# Altium project Project-Files.PrjPcb
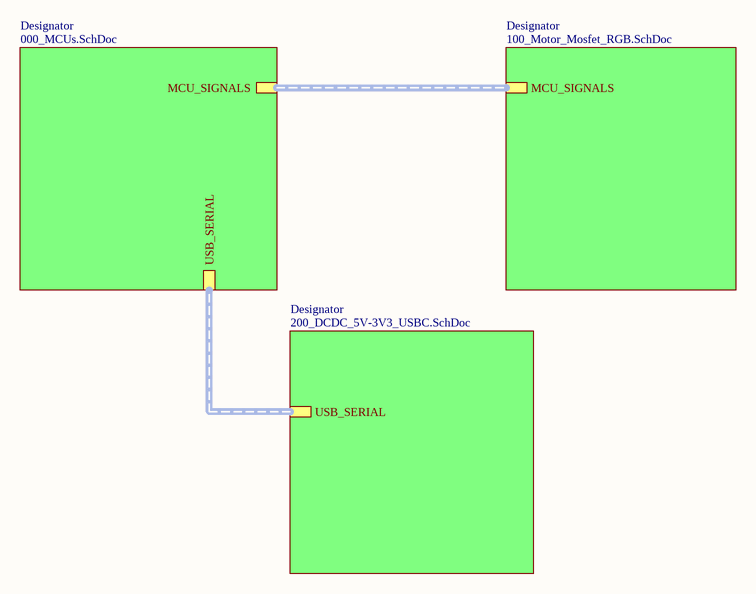
[diagram p0: Main.SchDoc]
4 sheets, 68 parts. Net scope: hierarchical (ports join the sheet entries above them; power ports are global).
Board file: PCB_v1.PcbDoc
Sheets:
  Main.SchDoc
    Designator = 000_MCUs.SchDoc
    Designator = 100_Motor_Mosfet_RGB.SchDoc
    Designator = 200_DCDC_5V-3V3_USBC.SchDoc

## Sheet Main.SchDoc
size A; SheetNumber: 1; SheetTotal: 4

### Sub-sheets
Designator = 000_MCUs.SchDoc: MCU_SIGNALS (harness MCU_SIGNALS), USB_SERIAL (harness USB_SERIAL)
Designator = 100_Motor_Mosfet_RGB.SchDoc: MCU_SIGNALS (harness MCU_SIGNALS)
Designator = 200_DCDC_5V-3V3_USBC.SchDoc: USB_SERIAL (harness USB_SERIAL)

## Sheet 000_MCUs.SchDoc
size A4; SheetNumber: 2; SheetTotal: 4
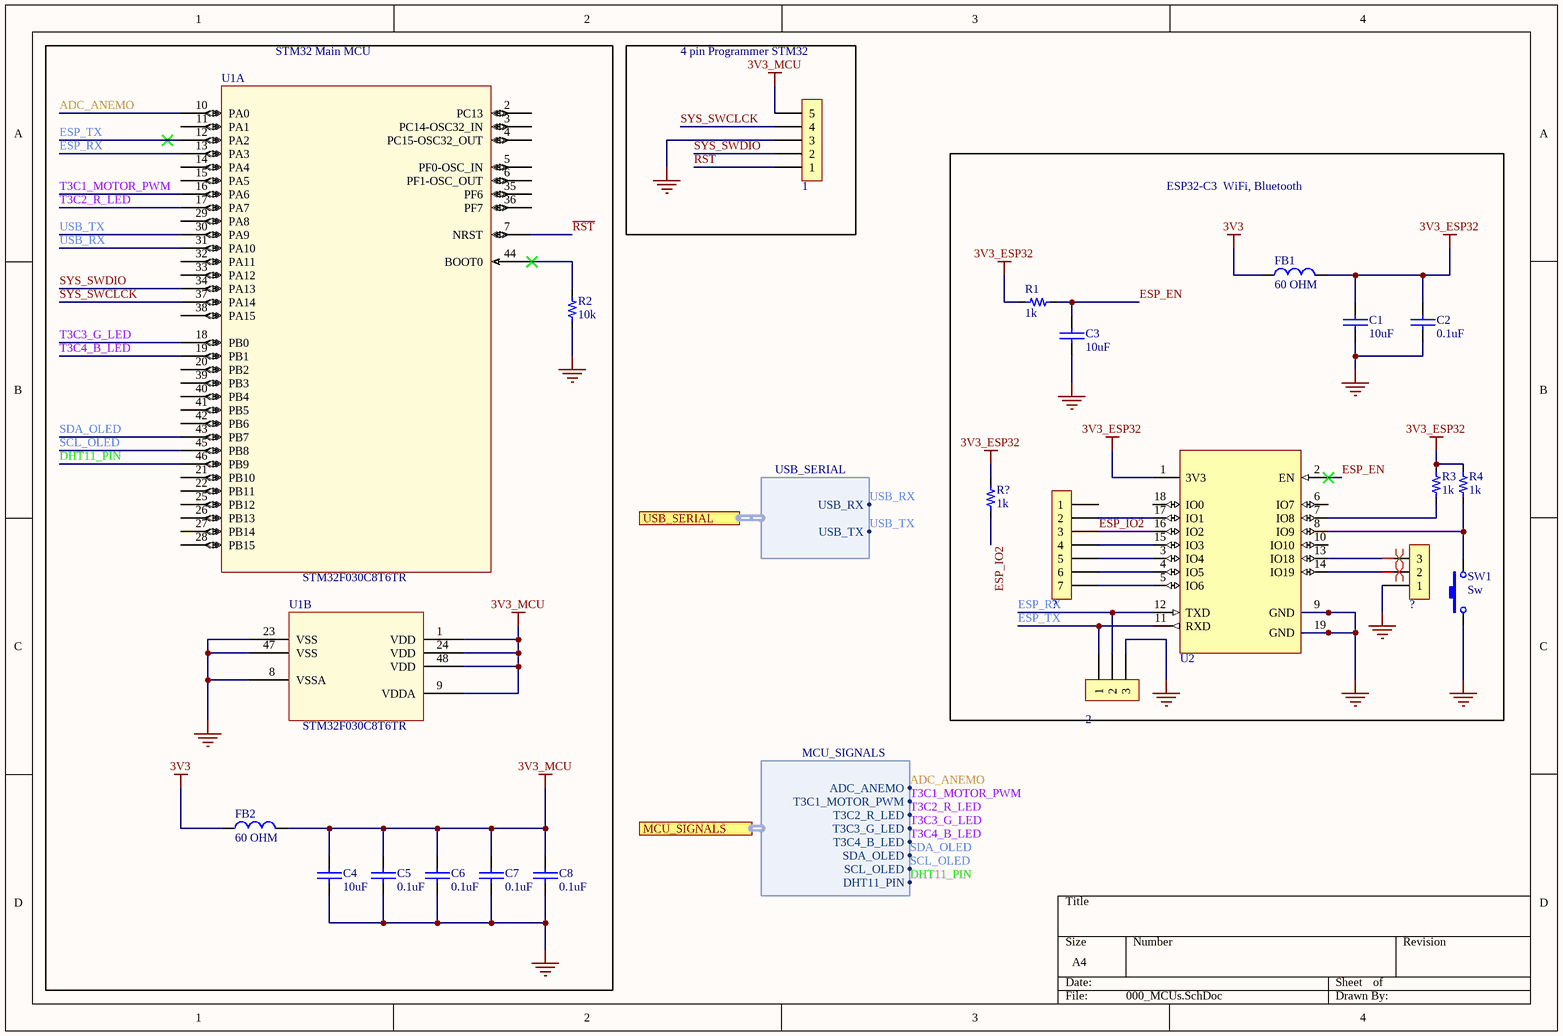
[diagram p1: 000_MCUs.SchDoc]

### Parts
(Parts that share a designator on the sheet are numbered #1, #2 ... from top to bottom, then left to right.)
1  5x1  [H_5x1_TH_100mil]  (value not drawn)  (no BOM)
2  3x1  [H_3X1_TH_100mil]  (value not drawn)  (no BOM)
?#1  7x1  [H_7x1_TH_100mil]  (value not drawn)  (no BOM)
?#2  3x1  [H_3X1_TH_100mil]  (value not drawn)  (no BOM)
C1  value 10uF  [0805_cap]  (hidden comment: 10uF 25V)
C2  value 0.1uF  [0603_cap]  (hidden comment: 0.1uF 50V)
C3  value 10uF  [0805_cap]  (hidden comment: 10uF 25V)
C4  value 10uF  [0805_cap]  (hidden comment: 10uF 25V)
C5  value 0.1uF  [0603_cap]  (hidden comment: 0.1uF 50V)
C6  value 0.1uF  [0603_cap]  (hidden comment: 0.1uF 50V)
C7  value 0.1uF  [0603_cap]  (hidden comment: 0.1uF 50V)
C8  value 0.1uF  [0603_cap]  (hidden comment: 0.1uF 50V)
FB1  value 60 OHM  [0603_fb]  (hidden comment: 60OHM 2A)
FB2  value 60 OHM  [0603_fb]  (hidden comment: 60OHM 2A)
R1  value 1k  [0603_res]  (hidden comment: 1k 1/10W)
R2  value 10k  [0603_res]  (hidden comment: 10k 1/10W)
R3  value 1k  [0603_res]  (hidden comment: 1k 1/10W)
R4  value 1k  [0603_res]  (hidden comment: 1k 1/10W)
R?  value 1k  [0603_res]  (hidden comment: 1k 1/10W)
SW1  Sw  [Sw_PUSH_4.5x4.5x5mm]
U1  STM32F030C8T6TR  [LQFP48_7x7mm]  (parts A,B of 2)
U2  ESP32-C3-WROOM-02-N4  [ESP32-C3-WROOM-02-N4]  (value not drawn)

### Blocks framed on the sheet
STM32 Main MCU: C4-C8 FB2 R2 U1
4 pin Programmer STM32: 1
ESP32-C3  WiFi, Bluetooth: 2 ?#1 ?#2 C1-C3 FB1 R1 R3 R4 R? SW1 U2

### Ports
MCU_SIGNALS (harness MCU_SIGNALS, see Main[2A], 100_Motor_Mosfet_RGB[1B]), USB_SERIAL (harness USB_SERIAL, see Main[2B], 200_DCDC_5V-3V3_USBC[3B])

### Harnesses
MCU_SIGNALS: ADC_ANEMO, T3C1_MOTOR_PWM, T3C2_R_LED, T3C3_G_LED, T3C4_B_LED, SDA_OLED, SCL_OLED, DHT11_PIN
USB_SERIAL: USB_RX, USB_TX

### Nets
3V3: FB1.1 FB2.1
3V3_ESP32: C1.1 C2.1 FB1.2 R1.2 R3.2 R4.2 R?.2 U2.1(3V3)
3V3_MCU: 1.5 C4.1 C5.1 C6.1 C7.1 C8.1 FB2.2 U1.1(VDD) U1.9(VDDA) U1.24(VDD) U1.48(VDD)
GND: 1.3 2.3 ?#2.1 C1.2 C2.2 C3.2 C4.2 C5.2 C6.2 C7.2 C8.2 R2.1 SW1.1 U1.8(VSSA) U1.23(VSS) U1.47(VSS) U2.9(GND) U2.19(GND)
ADC_ANEMO: U1.10(PA0) ; port MCU_SIGNALS.ADC_ANEMO
DHT11_PIN: U1.46(PB9) ; port MCU_SIGNALS.DHT11_PIN
ESP_EN: C3.1 R1.1 U2.2(EN)
ESP_IO2: ?#1.3 R?.1 U2.16(IO2)
ESP_RX: 2.2 U1.13(PA3) U2.12(TXD)
ESP_TX: 2.1 U1.12(PA2) U2.11(RXD)
~{RST}: 1.1 U1.7(NRST)
SCL_OLED: U1.45(PB8) ; port MCU_SIGNALS.SCL_OLED
SDA_OLED: U1.43(PB7) ; port MCU_SIGNALS.SDA_OLED
SYS_SWCLCK: 1.4 U1.37(PA14)
SYS_SWDIO: 1.2 U1.34(PA13)
T3C1_MOTOR_PWM: U1.16(PA6) ; port MCU_SIGNALS.T3C1_MOTOR_PWM
T3C2_R_LED: U1.17(PA7) ; port MCU_SIGNALS.T3C2_R_LED
T3C3_G_LED: U1.18(PB0) ; port MCU_SIGNALS.T3C3_G_LED
T3C4_B_LED: U1.19(PB1) ; port MCU_SIGNALS.T3C4_B_LED
USB_RX: U1.31(PA10) ; port USB_SERIAL.USB_RX
USB_TX: U1.30(PA9) ; port USB_SERIAL.USB_TX
Net?#1_2: ?#1.2 U2.17(IO1)
Net?#1_4: ?#1.4 U2.15(IO3)
Net?#1_5: ?#1.5 U2.3(IO4)
Net?#1_6: ?#1.6 U2.4(IO5)
Net?#1_7: ?#1.7 U2.5(IO6)
Net?#2_2: ?#2.2 U2.14(IO19)
Net?#2_3: ?#2.3 U2.13(IO18)
NetR2_2: R2.2 U1.44(BOOT0)
NetR3_1: R3.1 U2.7(IO8)
NetR4_1: R4.1 SW1.2 U2.8(IO9)

Not connected (* = marked no-connect by the designer): ?#1 1; U1 2(PC13) 3(PC14-OSC32_IN) 4(PC15-OSC32_OUT) 5(PF0-OSC_IN) 6(PF1-OSC_OUT) 11(PA1) 14(PA4) 15(PA5) 20(PB2) 21(PB10) 22(PB11) 25(PB12) 26(PB13) 27(PB14) 28(PB15) 29(PA8) 32(PA11) 33(PA12) 35(PF6) 36(PF7) 38(PA15) 39(PB3) 40(PB4) 41(PB5) 42(PB6); U2 6(IO7) 10(IO10) 18(IO0)

### Layout directives
differential pair; differential pair class USB_2.0: Net?#2_2, Net?#2_3

### Library data of the parts
1 = H_Male_5x1_TH_100mil: ComponentLink1Description: LCSC
2 ?#2 = H_Male_3x1_TH_100mil: ComponentLink1Description: LCSC
?#1 = H_Male_7x1_TH_100mil: ComponentLink1Description: LCSC
C1 C3 C4 = Cap_10uF_0805_25V_: 25V 10uF X5R ±10% 0805 Multilayer Ceramic Capacitors MLCC - SMD/SMT ROHS; Manufacturer: Samsung Electro-Mechanics; Manufacturer Part Number: CL21A106KAYNNNE; Supplier 1: LCSC; Supplier Part Number 1: C15850; ComponentLink1Description: LCSC; ComponentLink1URL: https://lcsc.com/product-detail/Multilayer-Ceramic-Capacitors-MLCC-SMD-SMT_Samsung-Electro-Mechanics-CL21A106KAYNNNE_C15850.html
C2 C5-C8 = Cap_0.1uF_0603_50V: 50V 100nF Y5V -20%~+80% 0603 Multilayer Ceramic Capacitors MLCC - SMD/SMT ROHS; Manufacturer: Walsin Tech Corp; Manufacturer Part Number: 0603F104Z500CT; Supplier 1: LCSC; Supplier Part Number 1: C83060; ComponentLink1Description: LCSC; ComponentLink1URL: https://www.lcsc.com/product-detail/Multilayer-Ceramic-Capacitors-MLCC-SMD-SMT_Walsin-Tech-Corp-0603F104Z500CT_C83060.html
FB1 FB2 = FB_60_0603_2A: 2A 1 100mΩ 60Ω@100MHz ±25% 0603 Ferrite Beads ROHS; Manufacturer: TAI-TECH; Manufacturer Part Number: HCB1608KF-600T20; ComponentLink1Description: LCSC; ComponentLink1URL: https://www.lcsc.com/product-detail/Ferrite-Beads_TAI-TECH-HCB1608KF-600T20_C369516.html; Supplier 1: LCSC; Supplier Part Number 1: C369516
R1 R3 R4 R? = Res_1k_0603_1/10W: RES SMD 1k OHM 5% 1/10W 0603; Manufacturer: FOJAN; Manufacturer Part Number: FRC0603J102 TS; ComponentLink1URL: https://www.lcsc.com/product-detail/Chip-Resistor-Surface-Mount_FOJAN-FRC0603J102-TS_C2907113.html; Supplier 1: LCSC; Supplier Part Number 1: C2907113; ComponentLink1Description: LCSC
R2 = Res_10k_0603_1/10W: RES SMD 10k OHM 5% 1/10W 0603; Manufacturer: FOJAN; Manufacturer Part Number: FRC0603J103TS; ComponentLink1URL: https://www.lcsc.com/product-detail/Chip-Resistor-Surface-Mount_FOJAN-FRC0603J103TS_C2930027.html; Supplier 1: LCSC; Supplier Part Number 1: C2930027; ComponentLink1Description: LCSC
SW1 = Sw_PUSH_4.5x4.5x5.0xmm: SWITCH TACTILE SPST-NO 0.05A 12V; Manufacturer: BZCN; Manufacturer Part Number: TSC015A05026A; Supplier 1: LCSC; Supplier Part Number 1: C2888509; Last modified by: N-A.Potosi; Last modified date: 20190222; ComponentLink1Description: LCSC; ComponentLink1URL: https://www.lcsc.com/product-detail/Tactile-Switches_BZCN-TSC015A05026A_C2888509.html
U1 = IC_STM32F030C8T6TR_LQFP48_7x7MM: IC MCU 32BIT 64KB FLASH 48LQFP; Manufacturer: STMicroelectronics; Manufacturer part number: STM32F030C8T6TR; Supplier 1: LCSC; Supplier Part Number 1: C23922; ComponentLink1Description: LCSC; ComponentLink1URL: https://www.lcsc.com/product-detail/ST-Microelectronics_STMicroelectronics-STM32F030C8T6_C23922.html
U2 = MCU_ESP32-C3-WROOM-02-N4: RF TXRX MOD BT WIFI PCB TH SMD; Manufacturer: Espressif Systems; Manufacturer Part Number: ESP32-C3-WROOM-02-N4; Supplier 1: LCSC; Supplier Part Number 1: C2934560; ComponentLink1Description: LCSC; ComponentLink1URL: https://lcsc.com/product-detail/WiFi-Modules_Espressif-Systems-ESP32-C3-WROOM-02-N4_C2934560.html

## Sheet 100_Motor_Mosfet_RGB.SchDoc
size A; SheetNumber: 3; SheetTotal: 4
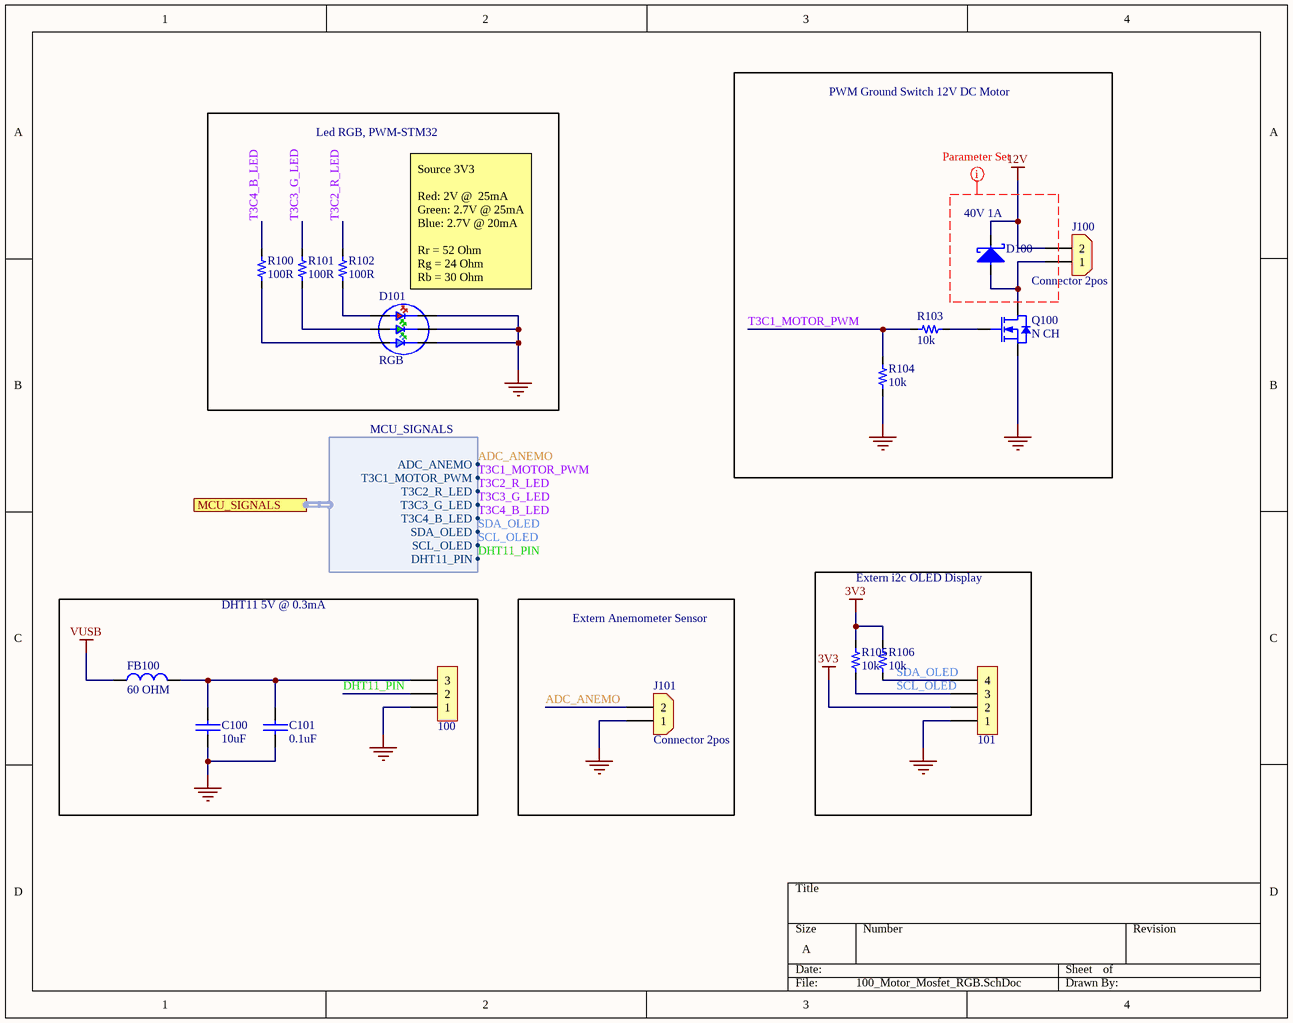
[diagram p2: 100_Motor_Mosfet_RGB.SchDoc]

### Parts
100  3x1  [H_3X1_TH_100mil]  (value not drawn)  (no BOM)
101  4x1  [H_4x1_TH_2.54mm]  (value not drawn)  (no BOM)
C100  value 10uF  [0805_cap]  (hidden comment: 10uF 25V)
C101  value 0.1uF  [0603_cap]  (hidden comment: 0.1uF 50V)
D100  40V 1A  [SOD_123]
D101  RGB  [RGB_NS_3.5X3.7]
FB100  value 60 OHM  [0603_fb]  (hidden comment: 60OHM 2A)
J100  Connector 2pos  [CON_2x1_TH_5MM]
J101  Connector 2pos  [CON_2x1_TH_5MM]
Q100  N CH  [SOT_23_3]
R100  value 100R  [0603_res]  (hidden comment: 100R 1/10W)
R101  value 100R  [0603_res]  (hidden comment: 100R 1/10W)
R102  value 100R  [0603_res]  (hidden comment: 100R 1/10W)
R103  value 10k  [0603_res]  (hidden comment: 10k 1/10W)
R104  value 10k  [0603_res]  (hidden comment: 10k 1/10W)
R105  value 10k  [0603_res]  (hidden comment: 10k 1/10W)
R106  value 10k  [0603_res]  (hidden comment: 10k 1/10W)

### Blocks framed on the sheet
PWM Ground Switch 12V DC Motor: D100 J100 Q100 R103 R104
Led RGB, PWM-STM32: D101 R100-R102
DHT11 5V @ 0.3mA: 100 C100 C101 FB100
Extern Anemometer Sensor: J101
Extern i2c OLED Display: 101 R105 R106

### Ports
MCU_SIGNALS (harness MCU_SIGNALS, see Main[3A], 000_MCUs[2D])

### Harnesses
MCU_SIGNALS: ADC_ANEMO, T3C1_MOTOR_PWM, T3C2_R_LED, T3C3_G_LED, T3C4_B_LED, SDA_OLED, SCL_OLED, DHT11_PIN

### Nets
3V3: 101.2 R105.2 R106.2
12V: D100.1 J100.2
GND: 100.1 101.1 C100.2 C101.2 D101.1 D101.2 D101.3 J101.1 Q100.2(S) R104.1
VUSB: FB100.1
ADC_ANEMO: J101.2 ; port MCU_SIGNALS.ADC_ANEMO
DHT11_PIN: 100.2 ; port MCU_SIGNALS.DHT11_PIN
SCL_OLED: 101.3 R105.1 ; port MCU_SIGNALS.SCL_OLED
SDA_OLED: 101.4 R106.1 ; port MCU_SIGNALS.SDA_OLED
T3C1_MOTOR_PWM: R103.2 R104.2 ; port MCU_SIGNALS.T3C1_MOTOR_PWM
T3C2_R_LED: R102.2 ; port MCU_SIGNALS.T3C2_R_LED
T3C3_G_LED: R101.2 ; port MCU_SIGNALS.T3C3_G_LED
T3C4_B_LED: R100.2 ; port MCU_SIGNALS.T3C4_B_LED
Net100_3: 100.3 C100.1 C101.1 FB100.2
NetD100_2: D100.2 J100.1 Q100.3(D)
NetD101_4: D101.4 R102.1
NetD101_5: D101.5 R101.1
NetD101_6: D101.6 R100.1
NetQ100_1: Q100.1(G) R103.1

### Layout directives
net class 12V_2A: (no net found under the mark)

### Notes on the sheet
- (near D101) Source 3V3
  Red: 2V @  25mA
  Green: 2.7V @ 25mA
  Blue: 2.7V @ 20mA
  Rr = 52 Ohm
  Rg = 24 Ohm
  Rb = 30 Ohm

### Library data of the parts
100 = H_Male_3x1_TH_100mil: ComponentLink1Description: LCSC
101 = H_Male_4x1_TH_100mil: ComponentLink1Description: LCSC
C100 = Cap_10uF_0805_25V_: as C1 on sheet 000_MCUs; Supplier 1: LCSC; Supplier Part Number 1: C15850; ComponentLink1Description: LCSC; ComponentLink1URL: https://lcsc.com/product-detail/Multilayer-Ceramic-Capacitors-MLCC-SMD-SMT_Samsung-Electro-Mechanics-CL21A106KAYNNNE_C15850.html
C101 = Cap_0.1uF_0603_50V: as C2 on sheet 000_MCUs; Supplier 1: LCSC; Supplier Part Number 1: C83060; ComponentLink1Description: LCSC; ComponentLink1URL: https://www.lcsc.com/product-detail/Multilayer-Ceramic-Capacitors-MLCC-SMD-SMT_Walsin-Tech-Corp-0603F104Z500CT_C83060.html
D100 = D_Schottky_40V_1A_SOD_123F: DIODE SCHOTTKY 40V 1A SOD123F; Manufacturer: Shanghai Prisemi Elec; Manufacturer Part Number: PSBD1DF40V1H; Supplier 1: LCSC; Supplier Part Number 1: C110730; ComponentLink1Description: LCSC; ComponentLink1URL: https://www.lcsc.com/product-detail/Switching-Diode_Shanghai-Prisemi-Elec-PSBD1DF40V1H_C110730.html
D101 = LED_RGB_3535_SMD: -30℃~+85℃ RGB 110° 3535(mm) Light Emitting Diodes (LED) ROHS; Manufacturer: Foshan NationStar Optoelectronics; Manufacturer Part Number: RS-3535MWAM; Supplier 1: LCSC; Supplier Part Number 1: C842778; ComponentLink1Description: LCSC; ComponentLink1URL: https://www.lcsc.com/product-detail/Light-Emitting-Diodes-LED_Foshan-NationStar-Optoelectronics-RS-3535MWAM_C842778.html
FB100 = FB_60_0603_2A: as FB1 on sheet 000_MCUs; ComponentLink1Description: LCSC; ComponentLink1URL: https://www.lcsc.com/product-detail/Ferrite-Beads_TAI-TECH-HCB1608KF-600T20_C369516.html; Supplier 1: LCSC; Supplier Part Number 1: C369516
J100 J101 = Con_2x1_TH_5mm: 2POS 5MM; Manufacturer: JILN; Manufacturer Part Number: JL126-50002G01; Supplier 1: LCSC; Supplier Part Number 1: C394556; ComponentLink1Description: Digi-Key; ComponentLink1URL: https://www.lcsc.com/product-detail/Screw-terminal_JILN-JL126-50002G01_C394556.html
Q100 = Q_NFET_20V_3.2A_SOT23: MOSFET N-CH 20V SOT23; Manufacturer: Doeshare; Manufacturer Part Number: DN2302S; Supplier 1: LCSC; Supplier Part Number 1: C2931750; ComponentLink1Description: LCSC; ComponentLink1URL: https://www.lcsc.com/product-detail/MOSFETs_Doeshare-DN2302S_C2931750.html
R100-R102 = Res_100R_0603_1/10W: RES SMD 100R OHM 5% 1/10W 0603; Manufacturer: FOJAN; Manufacturer Part Number: FRC0603J101 TS; ComponentLink1URL: https://www.lcsc.com/product-detail/Chip-Resistor-Surface-Mount_FOJAN-FRC0603J101-TS_C2907089.html; Supplier 1: LCSC; Supplier Part Number 1: C2907089; ComponentLink1Description: LCSC
R103-R106 = Res_10k_0603_1/10W: as R2 on sheet 000_MCUs; ComponentLink1URL: https://www.lcsc.com/product-detail/Chip-Resistor-Surface-Mount_FOJAN-FRC0603J103TS_C2930027.html; Supplier 1: LCSC; Supplier Part Number 1: C2930027; ComponentLink1Description: LCSC

## Sheet 200_DCDC_5V-3V3_USBC.SchDoc
size B; SheetNumber: 4; SheetTotal: 4
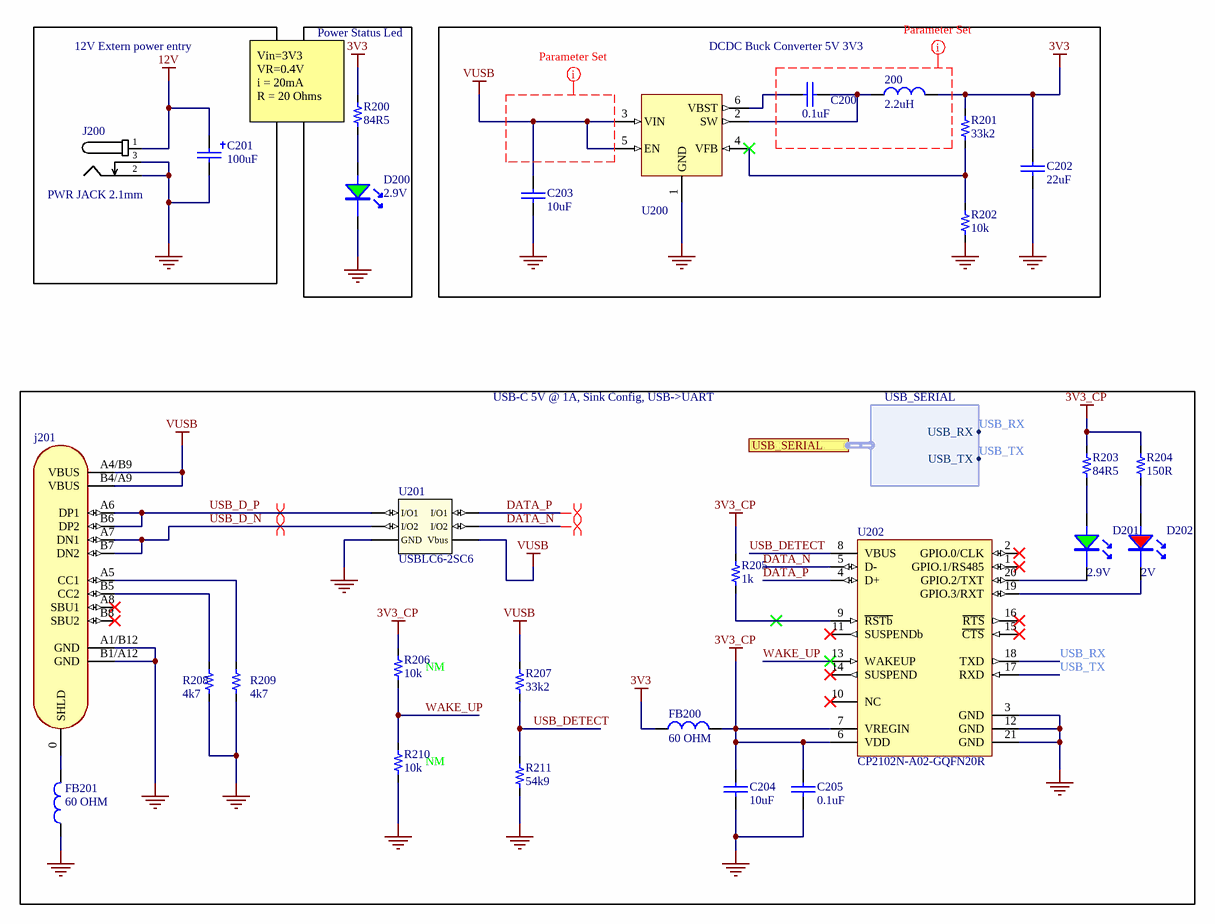
[diagram p3: 200_DCDC_5V-3V3_USBC.SchDoc]

### Parts
200  value 2.2uH  [Ind_5.8*5.2_NS]  (hidden comment: 2.2uH 4A)
C200  value 0.1uF  [0603_cap]  (hidden comment: 0.1uF 50V)
C201  value 100uF  [CAP_TH_2.5MM_6.3*12MM]  (hidden comment: 100uF 35V)
C202  value 22uF  [0603_cap]  (hidden comment: 22uF 10V)
C203  value 10uF  [0603_cap]  (hidden comment: 10uF 10V)
C204  value 10uF  [0603_cap]  (hidden comment: 10uF 10V)
C205  value 0.1uF  [0603_cap]  (hidden comment: 0.1uF 50V)
D200  2.9V  [0805_LED]
D201  2.9V  [0805_LED]
D202  2V  [0805_LED]
FB200  value 60 OHM  [0603_fb]  (hidden comment: 60OHM 2A)
FB201  value 60 OHM  [0603_fb]  (hidden comment: 60OHM 2A)
J200  PWR JACK 2.1mm  [CON_POWER_BARREL_2.1MM_3CONN]
j201  USB C  [CON_USB_C_16P_RA]  (value not drawn)
R200  value 84R5  [0603_res]  (hidden comment: 84R5 1/10W)
R201  value 33k2  [0603_res]  (hidden comment: 33k2 1/10W)
R202  value 10k  [0603_res]  (hidden comment: 10k 1/10W)
R203  value 84R5  [0603_res]  (hidden comment: 84R5 1/10W)
R204  value 150R  [0603_res]  (hidden comment: 150R 1/10W)
R205  value 1k  [0603_res]  (hidden comment: 1k 1/10W)
R206  value 10k  Usage: NM  [0603_res]  (hidden comment: 10k 1/10W)
R207  value 33k2  [0603_res]  (hidden comment: 33k2 1/10W)
R208  value 4k7  [0603_res]  (hidden comment: 4k7 1/10W)
R209  value 4k7  [0603_res]  (hidden comment: 4k7 1/10W)
R210  value 10k  Usage: NM  [0603_res]  (hidden comment: 10k 1/10W)
R211  value 54k9  [0603_res]  (hidden comment: 54k9 1/10W)
U200  TPS564201DDCR  [SOT_23_6]  (value not drawn)
U201  USBLC6-2SC6  [SOT_23_6]
U202  CP2102N-A02-GQFN20R  [WFQFN_20_EP_3X3MM]

### Blocks framed on the sheet
12V Extern power entry: C201 J200
Power Status Led: D200 R200
DCDC Buck Converter 5V 3V3: 200 C200 C202 C203 R201 R202 U200
USB-C 5V @ 1A, Sink Config, USB->UART: C204 C205 D201 D202 FB200 FB201 j201 R203-R211 U201 U202

### Ports
USB_SERIAL (harness USB_SERIAL, see Main[2C], 000_MCUs[2C])

### Harnesses
USB_SERIAL: USB_RX, USB_TX

### Nets
3V3: 200.2 C202.1 FB200.1 R200.1 R201.2
3V3_CP: C204.1 C205.1 FB200.2 R203.2 R204.2 R205.2 R206.2 U202.6(VDD) U202.7(VREGIN)
12V: C201.1 J200.1
GND: C201.2 C202.2 C203.2 C204.2 C205.2 D200.2 FB201.1 J200.2 J200.3 j201.A1/B12(GND) j201.B1/A12(GND) R202.1 R208.1 R209.1 R210.1 R211.1 U200.1(GND) U201.2(GND) U202.3(GND) U202.12(GND) U202.21(GND)
VUSB: C203.1 j201.A4/B9(VBUS) j201.B4/A9(VBUS) R207.2 U200.3(VIN) U200.5(EN) U201.5(Vbus)
DATA_N: U201.4(I/O2) U202.5(D-)
DATA_P: U201.6(I/O1) U202.4(D+)
USB_D_N: j201.A7(DN1) j201.B7(DN2) U201.3(I/O2)
USB_D_P: j201.A6(DP1) j201.B6(DP2) U201.1(I/O1)
USB_DETECT: R207.1 R211.2 U202.8(VBUS)
USB_RX: U202.18(TXD) ; port USB_SERIAL.USB_RX
USB_TX: U202.17(RXD) ; port USB_SERIAL.USB_TX
WAKE_UP: R206.1 R210.2 U202.13(WAKEUP)
Net200_1: 200.1 C200.1 U200.2(SW)
NetC200_2: C200.2 U200.6(VBST)
NetD200_1: D200.1(A) R200.2
NetD201_1: D201.1(A) R203.1
NetD201_2: D201.2 U202.20(GPIO.2/TXT)
NetD202_1: D202.1(A) R204.1
NetD202_2: D202.2 U202.19(GPIO.3/RXT)
NetFB201_2: FB201.2 j201.0(SHLD)
Netj201_A5: j201.A5(CC1) R209.2
Netj201_B5: j201.B5(CC2) R208.2
NetR201_1: R201.1 R202.2 U200.4(VFB)
NetR205_1: R205.1 U202.9(~{RSTb})

Not connected (* = marked no-connect by the designer): j201 A8(SBU1)* B8(SBU2)*; U202 1(GPIO.1/RS485)* 2(GPIO.0/CLK)* 10(NC)* 11(SUSPENDb)* 14(SUSPEND)* 15(~{CTS})* 16(~{RTS})*

### Layout directives
differential pair; differential pair class USB_2.0: DATA_N, DATA_P, USB_D_N, USB_D_P
net class 5V_1A: (no net found under the mark)

### Notes on the sheet
- (near R200) Vin=3V3
  VR=0.4V
  i = 20mA
  R = 20 Ohms

### Library data of the parts
200 = Inductor_2.2uH_4A_5.8*5.2mm: 4A 2.2uH ±20% 22.1mΩ SMD,5.8x5.2mm Inductors (SMD) ROHS; Manufacturer: SHOU HAN; Manufacturer Part Number: CY54-2.2UH; Supplier 1: LCSC; Supplier Part Number 1: C2929427; ComponentLink1Description: LCSC; ComponentLink1URL: https://lcsc.com/product-detail/Inductors-SMD_SHOU-HAN-CY54-2-2UH_C2929427.html
C200 C205 = Cap_0.1uF_0603_50V: as C2 on sheet 000_MCUs; Supplier 1: LCSC; Supplier Part Number 1: C83060; ComponentLink1Description: LCSC; ComponentLink1URL: https://www.lcsc.com/product-detail/Multilayer-Ceramic-Capacitors-MLCC-SMD-SMT_Walsin-Tech-Corp-0603F104Z500CT_C83060.html
C201 = Cap_100uF_ALU_TH_35V: 100uF 35V ±20% Plugin,D6.3xL12mm Aluminum Electrolytic Capacitors - Leaded ROHS; Manufacturer: HRK; Manufacturer Part Number: 35V100uF CD110; Supplier 1: LCSC; Supplier Part Number 1: C2960381; ComponentLink1Description: LCSC; ComponentLink1URL: https://lcsc.com/product-detail/Aluminum-Electrolytic-Capacitors-Leaded_HRK-35V100uF-CD110_C2960381.html
C202 = Cap_22uF_0603_10V: 10V 22uF X5R ±20% 0603 Multilayer Ceramic Capacitors MLCC - SMD/SMT ROHS; Manufacturer: HRE; Manufacturer Part Number: CGA0603X5R226M100JT; Supplier 1: LCSC; Supplier Part Number 1: C6119863; ComponentLink1Description: LCSC; ComponentLink1URL: https://lcsc.com/product-detail/Multilayer-Ceramic-Capacitors-MLCC-SMD-SMT_HRE-CGA0603X5R226M100JT_C6119863.html
C203 C204 = Cap_10uF_0603_10V: 10V 10uF X5R ±10% 0603 Multilayer Ceramic Capacitors MLCC - SMD/SMT ROHS; Manufacturer: CCTC; Manufacturer Part Number: TCC0603X5R106K100CT; Supplier 1: LCSC; Supplier Part Number 1: C380314; ComponentLink1Description: LCSC; ComponentLink1URL: https://www.lcsc.com/product-detail/Multilayer-Ceramic-Capacitors-MLCC-SMD-SMT_CCTC-TCC0603X5R106K100CT_C380314.html
D200 D201 = LED_0805_Green: LED GREEN CLEAR 0805 SMD; Manufacturer: XINGLIGHT; Manufacturer Part Number: XL-2012UGC; Supplier 1: LCSC; Supplier Part Number 1: C965815; ComponentLink1Description: LCSC; ComponentLink1URL: https://www.lcsc.com/product-detail/Light-Emitting-Diodes-LED_XINGLIGHT-XL-2012UGC_C965815.html
D202 = LED_0805_RED: LED RED CLEAR 0805 SMD; Manufacturer: XINGLIGHT; Manufacturer Part Number: XL-2012SURC; Supplier 1: LCSC; Supplier Part Number 1: C965812; ComponentLink1Description: LCSC; ComponentLink1URL: https://www.lcsc.com/product-detail/Light-Emitting-Diodes-LED_XINGLIGHT-XL-2012SURC_C965812.html
FB200 FB201 = FB_60_0603_2A: as FB1 on sheet 000_MCUs; ComponentLink1Description: LCSC; ComponentLink1URL: https://www.lcsc.com/product-detail/Ferrite-Beads_TAI-TECH-HCB1608KF-600T20_C369516.html; Supplier 1: LCSC; Supplier Part Number 1: C369516
J200 = Con_Power_Jack_2.1mm_3pins: CONN PWR JACK 2X5.5MM SOLDER; Manufacturer: HCTL; Manufacturer Part Number: HC-DC-005-2.0T; Supplier 1: LCSC; Supplier Part Number 1: C3010533; ComponentLink1Description: LCSC; ComponentLink1URL: https://www.lcsc.com/product-detail/AC-DC-Power-Connectors_HCTL-HC-DC-005-2-0T_C3010533.html
j201 = CON_USB_TYPEC_16P: 3A USB 3.1 1 Surface Mount 16P Female -40℃~+85℃ Type-C SMD USB Connectors ROHS; Manufacturer: SHOU HAN; Manufacturer Part Number: TYPE-C-3.1-16PIN; Supplier 1: LCSC; Supplier Part Number 1: C7507405; ComponentLink1Description: LCSC; ComponentLink1URL: https://lcsc.com/product-detail/USB-Connectors_SHOU-HAN-TYPE-C-3-1-16PIN_C7507405.html
R200 R203 = Res_84R5_0603_1/10W: 100mW Thick Film Resistor 50V ±100ppm/℃ ±1% 84.5Ω 0603 Chip Resistor - Surface Mount ROHS; Manufacturer: LIZ Elec; Manufacturer Part Number: CR0603FA84R5G; ComponentLink1URL: https://lcsc.com/product-detail/Chip-Resistor-Surface-Mount_LIZ-Elec-CR0603FA84R5G_C101216.html; Supplier 1: LCSC; Supplier Part Number 1: C101216; ComponentLink1Description: LCSC
R201 R207 = Res_33k2_0603_1/10W: 100mW Thick Film Resistor 75V ±100ppm/℃ ±1% 33.2kΩ 0603 Chip Resistor - Surface Mount ROHS; Manufacturer: YAGEO; Manufacturer Part Number: RC0603FR-0733K2L; ComponentLink1URL: https://lcsc.com/product-detail/Chip-Resistor-Surface-Mount_YAGEO-RC0603FR-0733K2L_C185338.html; Supplier 1: LCSC; Supplier Part Number 1: C185338; ComponentLink1Description: LCSC
R202 R206 R210 = Res_10k_0603_1/10W: as R2 on sheet 000_MCUs; ComponentLink1URL: https://www.lcsc.com/product-detail/Chip-Resistor-Surface-Mount_FOJAN-FRC0603J103TS_C2930027.html; Supplier 1: LCSC; Supplier Part Number 1: C2930027; ComponentLink1Description: LCSC
R204 = Res_150R_0603_1/10W: 100mW Thick Film Resistor 75V ±100ppm/℃ ±1% 150Ω 0603 Chip Resistor - Surface Mount ROHS; Manufacturer: RALEC; Manufacturer Part Number: RTT031500FTP; ComponentLink1URL: https://lcsc.com/product-detail/Chip-Resistor-Surface-Mount_RALEC-RTT031500FTP_C103302.html; Supplier 1: LCSC; Supplier Part Number 1: C103302; ComponentLink1Description: LCSC
R205 = Res_1k_0603_1/10W: as R1 on sheet 000_MCUs; ComponentLink1URL: https://www.lcsc.com/product-detail/Chip-Resistor-Surface-Mount_FOJAN-FRC0603J102-TS_C2907113.html; Supplier 1: LCSC; Supplier Part Number 1: C2907113; ComponentLink1Description: LCSC
R208 R209 = Res_4k7_0603_1/10W: 100mW Thick Film Resistor 75V ±1% 4.7kΩ 0603 Chip Resistor - Surface Mount ROHS; Manufacturer: VO; Manufacturer Part Number: SCR0603F4K7; ComponentLink1URL: https://lcsc.com/product-detail/Chip-Resistor-Surface-Mount_VO-SCR0603F4K7_C3016318.html; Supplier 1: LCSC; Supplier Part Number 1: C3016318; ComponentLink1Description: LCSC
R211 = Res_54k9_0603_1/10W: 100mW Thick Film Resistor 75V ±100ppm/℃ ±1% 54.9kΩ 0603 Chip Resistor - Surface Mount ROHS; Manufacturer: YAGEO; Manufacturer Part Number: RC0603FR-0754K9L; ComponentLink1URL: https://lcsc.com/product-detail/Chip-Resistor-Surface-Mount_YAGEO-RC0603FR-0754K9L_C185321.html; Supplier 1: LCSC; Supplier Part Number 1: C185321; ComponentLink1Description: LCSC
U200 = DCDC_SW_BUCK_4A_SOT23-6: IC REG BUCK ADJ 4A SOT23; Manufacturer: Texas Instruments; Manufacturer Part Number: TPS564201DDCR; Supplier 1: LCSC; Supplier Part Number 1: C464812; ComponentLink1Description: LCSC; ComponentLink1URL: https://lcsc.com/product-detail/DC-DC-Converters_Texas-Instruments-TPS564201DDCR_C464812.html
U201 = TVS_5.25V_2CH_SOT_23_6: TVS DIODE 5.25V 17V SOT23-6; Manufacturer: STMicroelectronics; ComponentLink1Description: LCSC; ComponentLink1URL: https://www.lcsc.com/product-detail/ESD-Protection-Devices_STMicroelectronics-USBLC6-2SC6_C7519.html; Supplier 1: LCSC; Manufacturer Part Number: USBLC6-2SC6; Supplier Part Number 1: C7519
U202 = IC_SGL_USB2UART-BRIDGE_20QFN: IC USB TO UART BRIDGE QFN20; Manufacturer: Silicon Labs; Manufacturer Part Number: CP2102N-A02-GQFN20R; Supplier 1: LCSC; Supplier Part Number 1: C969913; ComponentLink1Description: LCSC; ComponentLink1URL: https://www.lcsc.com/product-detail/USB-ICs_SILICON-LABS-CP2102N-A02-GQFN20R_C969913.html

## Nets that join several sheets
3V3: 000_MCUs (FB1.1 FB2.1), 100_Motor_Mosfet_RGB (101.2 R105.2 R106.2), 200_DCDC_5V-3V3_USBC (5 pins)
12V: 100_Motor_Mosfet_RGB (D100.1 J100.2), 200_DCDC_5V-3V3_USBC (C201.1 J200.1)
GND: 000_MCUs (18 pins), 100_Motor_Mosfet_RGB (10 pins), 200_DCDC_5V-3V3_USBC (21 pins)
VUSB: 100_Motor_Mosfet_RGB (FB100.1), 200_DCDC_5V-3V3_USBC (7 pins)
ADC_ANEMO: 000_MCUs (U1.10), 100_Motor_Mosfet_RGB (J101.2)
DHT11_PIN: 000_MCUs (U1.46), 100_Motor_Mosfet_RGB (100.2)
SCL_OLED: 000_MCUs (U1.45), 100_Motor_Mosfet_RGB (101.3 R105.1)
SDA_OLED: 000_MCUs (U1.43), 100_Motor_Mosfet_RGB (101.4 R106.1)
T3C1_MOTOR_PWM: 000_MCUs (U1.16), 100_Motor_Mosfet_RGB (R103.2 R104.2)
T3C2_R_LED: 000_MCUs (U1.17), 100_Motor_Mosfet_RGB (R102.2)
T3C3_G_LED: 000_MCUs (U1.18), 100_Motor_Mosfet_RGB (R101.2)
T3C4_B_LED: 000_MCUs (U1.19), 100_Motor_Mosfet_RGB (R100.2)
USB_RX: 000_MCUs (U1.31), 200_DCDC_5V-3V3_USBC (U202.18)
USB_TX: 000_MCUs (U1.30), 200_DCDC_5V-3V3_USBC (U202.17)